# EAGLE design Arduino_Leonardo-REV3b (EAGLE 6.2)
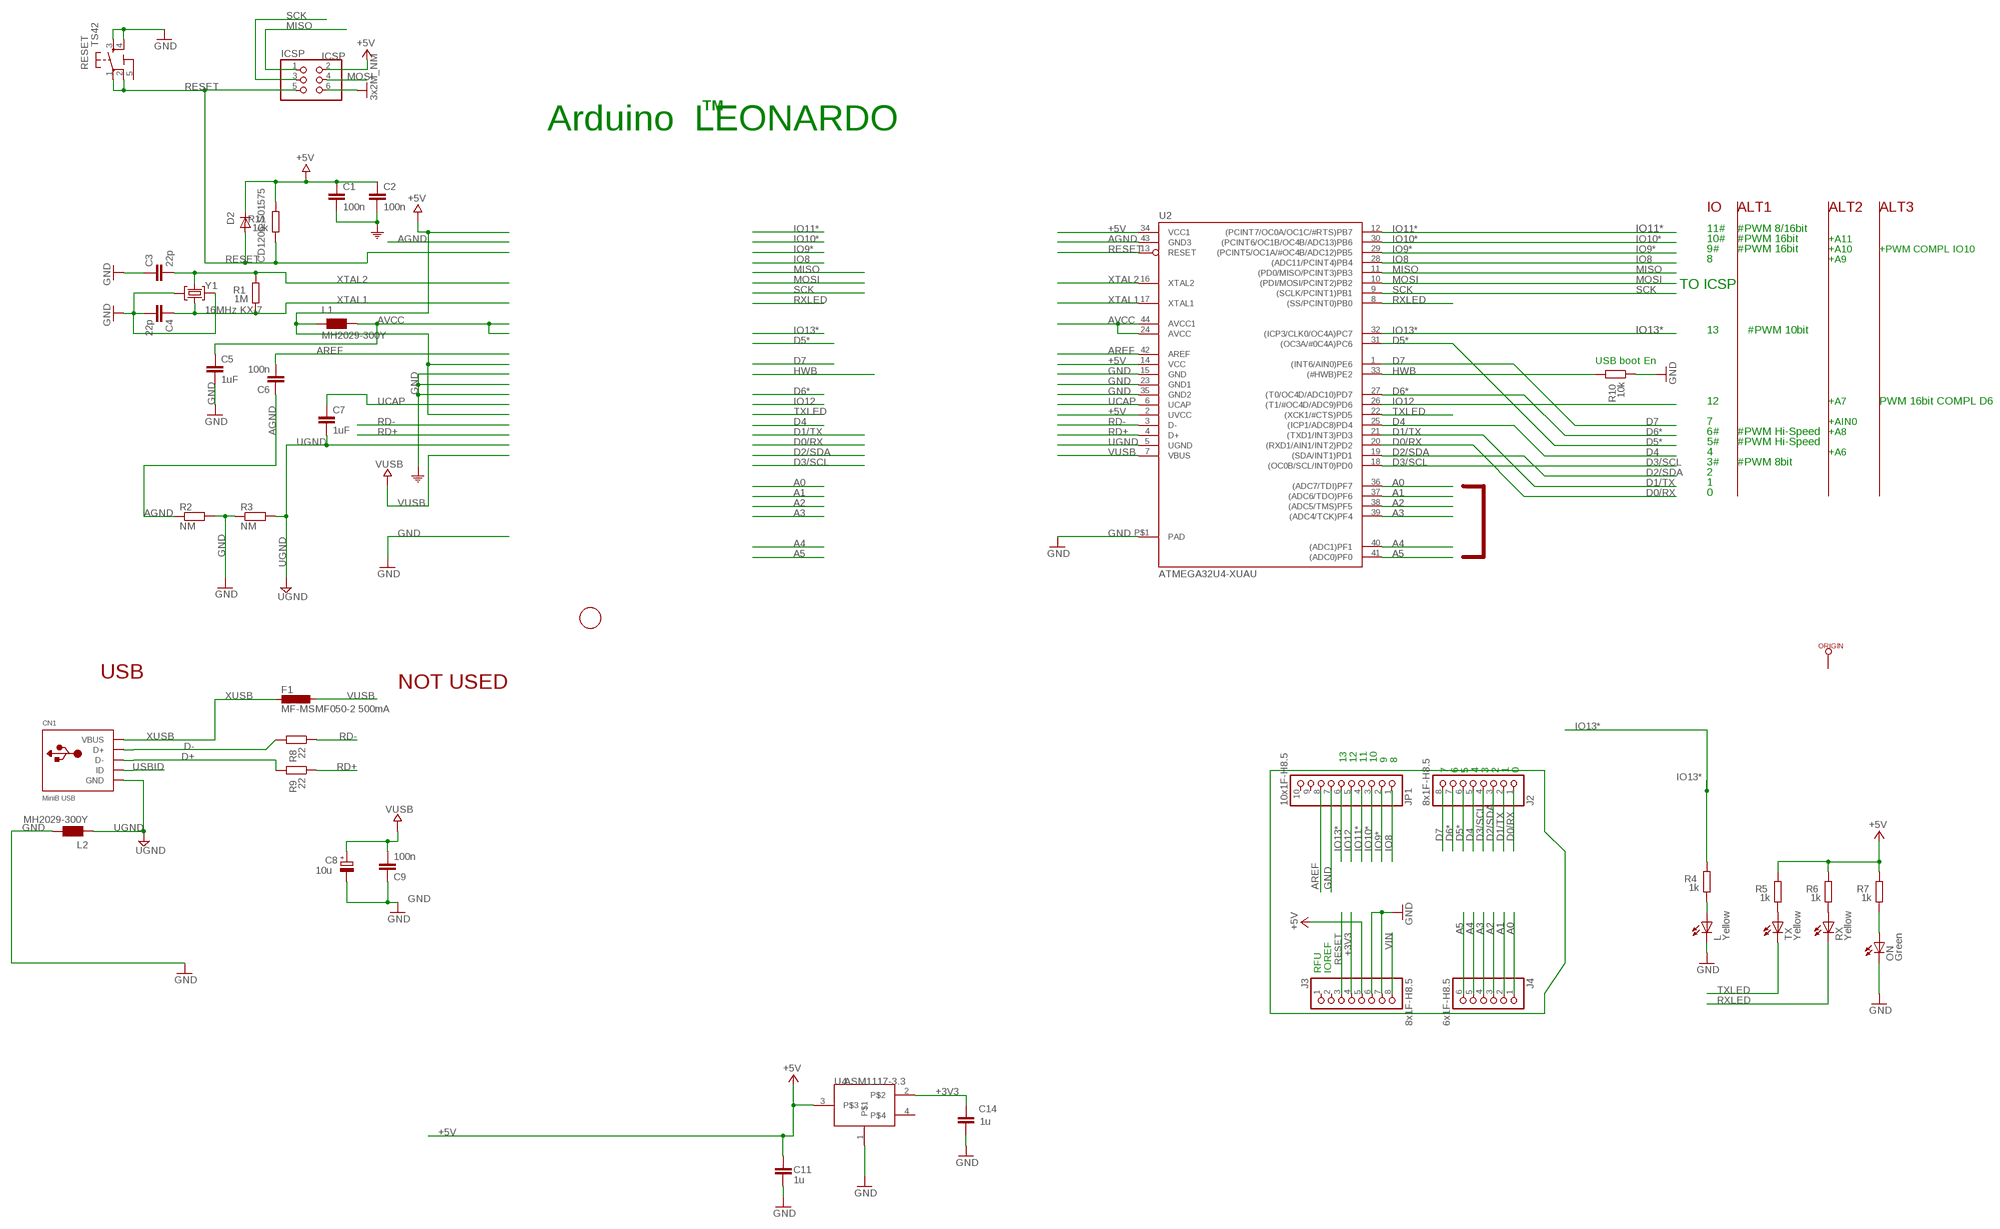
[diagram p0: schematic, sheet 1]

## Parts
C1  100n  C-EUC0805  [C0805]
C2  100n  C-EUC0805  [C0805]
C3  22p  C-EUC0805  [C0805]
C4  22p  C-EUC0805  [C0805]
C5  1uF  C-EUC0805  [C0805]
C6  100n  C-EUC0805  [C0805]
C7  1uF  C-EUC0805  [C0805]
C8  10u  CPOL-EUSMCB  [SMC_B]
C9  100n  C-EUC0805  [C0805]
C11  1u  C-EUC0805  [C0805]
C14  1u  C-EUC0805  [C0805]
CN1  MiniB USB  USBMINIB  [USB-MINIB]
D2  CD1206-S01575  DIODE-MINIMELF  [MINIMELF]
F1  MF-MSMF050-2 500mA  L-EUL1812  [L1812]
FID1  FIDUCIALMOUNT  [FIDUCIA-MOUNT]
ICSP  ICSP  PINHD-2X3  [2X03]
J2  8x1F-H8.5  PINHD-1X8  [1X08]
J3  8x1F-H8.5  PINHD-1X8  [1X08]
J4  6x1F-H8.5  PINHD-1X6  [1X06]
JP1  10x1F-H8.5  PINHD-1X10  [1X10]
L  Yellow  LEDCHIPLED_0805  [CHIPLED_0805]
L1  MH2029-300Y  WE-CBF_0805  [0805]
L2  MH2029-300Y  WE-CBF_0805  [0805]
ON  Green  LEDCHIPLED_0805  [CHIPLED_0805]
ORIGIN  TP_SP  [TP-SP]
R1  1M  R-EU_R0805  [R0805]
R2  NM  R-EU_R0805  [R0805]
R3  NM  R-EU_R0805  [R0805]
R4  1k  R-EU_R0805  [R0805]
R5  1k  R-EU_R0805  [R0805]
R6  1k  R-EU_R0805  [R0805]
R7  1k  R-EU_R0805  [R0805]
R8  22  R-EU_R0805  [R0805]
R9  22  R-EU_R0805  [R0805]
R10  10k  R-EU_R0805  [R0805]
R11  10k  R-EU_R0805  [R0805]
RESET  TS42  [TS42]
RX  Yellow  LEDCHIPLED_0805  [CHIPLED_0805]
TX  Yellow  LEDCHIPLED_0805  [CHIPLED_0805]
U2  ATMEGA32U4-XUAU  [TQFP44-PAD]
U4  ASM1117-3.3  [SOT223]
Y1  16MHz KX-7  CRYSTAL-3.2-2.5  [CRYSTAL-3.2-2.5]

## Nets
+3V3: C14.2 J3.4 U4.2
+5V [usbvcc]: C1.1 C2.1 C11.2 D2.C ICSP.2 J3.5 L1.1 R5.2 R6.2 R7.2 R11.2 U2.2(UVCC) U2.14(VCC) U2.34(VCC1) U4.3
A0: J4.1 U2.36((ADC7/TDI)PF7)
A1: J4.2 U2.37((ADC6/TDO)PF6)
A2: J4.3 U2.38((ADC5/TMS)PF5)
A3: J4.4 U2.39((ADC4/TCK)PF4)
A4: J4.5 U2.40((ADC1)PF1)
A5: J4.6 U2.41((ADC0)PF0)
AGND: C6.1 R2.1 U2.43(GND3)
AREF [aref]: C6.2 JP1.8 U2.42(AREF)
AVCC: C5.1 L1.2 U2.24(AVCC) U2.44(AVCC1)
D0/RX: J2.1 U2.20((RXD1/AIN1/INT2)PD2)
D1/TX: J2.2 U2.21((TXD1/INT3)PD3)
D2/SDA: J2.3 U2.19((SDA/INT1)PD1)
D3/SCL: J2.4 U2.18((OC0B/SCL/INT0)PD0)
D4: J2.5 U2.25((ICP1/ADC8)PD4)
D5*: J2.6 U2.31((OC3A/#0C4A)PC6)
D6*: J2.7 U2.27((T0/OC4D/ADC10)PD7)
D7: J2.8 U2.1((INT6/AIN0)PE6)
D+: CN1.D- R9.2
D-: CN1.D+ R8.2
GND [gnd]: C1.2 C2.2 C3.1 C4.2 C5.2 C8.- C9.1 C11.1 C14.1 ICSP.6 J3.6 J3.7 JP1.7 L2.2 L.C ON.C R2.2 R3.1 R10.1 RESET.3 RESET.4 U2.15(GND) U2.23(GND1) U2.35(GND2) U2.P$1(PAD) U4.1 Y1.2(GND) Y1.4(GND) ; supply symbol labelled 3x2M_NM, COM
HWB: R10.2 U2.33((#HWB)PE2)
IO8: JP1.1 U2.28((ADC11/PCINT4)PB4)
IO9*: JP1.2 U2.29((PCINT5/OC1A/#OC4B/ADC12)PB5)
IO10*: JP1.3 U2.30((PCINT6/OC1B/OC4B/ADC13)PB6)
IO11*: JP1.4 U2.12((PCINT7/OC0A/OC1C/#RTS)PB7)
IO12: JP1.5 U2.26((T1/#OC4D/ADC9)PD6)
IO13*: JP1.6 R4.2 U2.32((ICP3/CLK0/OC4A)PC7)
MISO: ICSP.1 U2.11((PD0/MISO/PCINT3)PB3)
MOSI: ICSP.4 U2.10((PDI/MOSI/PCINT2)PB2)
N$1: R5.1 TX.A
N$2: L.A R4.1
N$3: ON.A R7.1
N$4: R6.1 RX.A
RD+: R9.1 U2.4(D+)
RD-: R8.1 U2.3(D-)
RESET: D2.A ICSP.5 J3.3 R11.1 RESET.1 RESET.2 U2.13(RESET)
RXLED: RX.C U2.8((SS/PCINT0)PB0)
SCK: ICSP.3 U2.9((SCLK/PCINT1)PB1)
TXLED: TX.C U2.22((XCK1/#CTS)PD5)
UCAP: C7.1 U2.6(UCAP)
UGND [gnd]: C7.2 CN1.GND L2.1 R3.2 U2.5(UGND)
USBID: CN1.ID
VIN [power]: J3.8
VUSB: C8.+ C9.2 F1.1 U2.7(VBUS)
XTAL1: C4.1 R1.1 U2.17(XTAL1) Y1.1(C1)
XTAL2: C3.2 R1.2 U2.16(XTAL2) Y1.3(C2)
XUSB [usbvcc]: CN1.VBUS F1.2
Unconnected: J3.1 J3.2 JP1.9 JP1.10 ORIGIN.X(TESTP) U4.4

## Notes on the sheet
- TM
- Arduino  LEONARDO
- IO | ALT1 | ALT2 | ALT3
- 11# | #PWM 8/16bit
- 10# | #PWM 16bit | +A11
- 9# | #PWM 16bit | +A10 | +PWM COMPL IO10
- 8 | +A9
- TO ICSP
- 13 | #PWM 10bit
- USB boot En
- 12 | +A7 | PWM 16bit COMPL D6
- 7 | +AIN0
- 6# | #PWM Hi-Speed | +A8
- 5# | #PWM Hi-Speed
- 4 | +A6
- 3# | #PWM 8bit
- 2
- 1
- 0
- USB
- NOT USED
- 13 | 12 | 11 | 10 | 9 | 8
- 7 | 6 | 5 | 4 | 3 | 2 | 1 | 0
- RFU | IOREF

## Power pins joined to a net without a drawn wire
5-GND: RESET.5(5-GND)

## Library data of the parts
C1-C7 C9 C11 C14 = SmartPrj:C-EU: CAPACITOR, European symbol
C8 = rcl:CPOL-EU: POLARIZED CAPACITOR, European symbol
CN1 = adafruit:USB: USB Connectors USBMINIB - Surface Mount Female Mini-B USB Connector 4UConnector: 06564 By microbuilder.eu Thru-hole RA Female Mini-B USB Connector 4UConnector: 18732 By ladyada.net
D2 = diode:DIODE-: DIODE
F1 = rcl:L-EU: INDUCTOR, European symbol
FID1 = SmartPrj:FIDUCIALMOUNT
ICSP = SmartPrj:PINHD-2X3: PIN HEADER
J2 J3 = SmartPrj:PINHD-1X8: PIN HEADER
J4 = SmartPrj:PINHD-1X6: PIN HEADER
JP1 = SmartPrj:PINHD-1X10: PIN HEADER
L ON RX TX = led:LED: LED OSRAM: - CHIPLED LG R971, LG N971, LY N971, LG Q971, LY Q971, LO R971, LY R971 LH N974, LH R974 LS Q976, LO Q976, LY Q976 LO Q996 - Hyper CHIPLED LW Q18S LB Q993, LB Q99A, LB R99A - SideLED LS A670, LO A670, LY A670, LG A670, LP A670 LB A673, LV A673, LT A673, LW A673 LH A674 LY A675 LS A676, LA A676, LO A676, LY A676, LW A676 LS A679, LY A679, LG A679 - Hyper Micro SIDELED® LS Y876, LA Y876, LO Y876, LY Y876 LT Y87S - SmartLED LW L88C, LW L88S LB L89C, LB L89S, LG L890 LS L89K, LO L89K, LY L89K LS L896, LA L896, LO L896, LY L896 - TOPLED LS T670, LO T670, LY T670, LG T670, LP T670 LSG T670, LSP T670, LSY T670, LOP T670, LYG T670 LG T671, LOG T671, LSG T671 LB T673, LV T673, LT T673, LW T673 LH T674 LS T676, LA T676, LO T676, LY T676, LB T676, LH T676, LSB T676, LW T676 LB T67C, LV T67C, LT T67C, LS T67K, LO T67K, LY T67K, LW E67C LS E67B, LA E67B, LO E67B, LY E67B, LB E67C, LV E67C, LT E67C LW T67C LS T679, LY T679, LG T679 LS T770, LO T770, LY T770, LG T770, LP T770 LB T773, LV T773, LT T773, LW T773 LH T774 LS E675, LA E675, LY E675, LS T675 LS T776, LA T776, LO T776, LY T776, LB T776 LHGB T686 LT T68C, LB T68C - Hyper Mini TOPLED® LB M676 - Mini TOPLED Santana® LG M470 LS M47K, LO M47K, LY M47K Source: http://www.osram.convergy.de LUXEON: - LUMILED® LXK2-PW12-R00, LXK2-PW12-S00, LXK2-PW14-U00, LXK2-PW14-V00 LXK2-PM12-R00, LXK2-PM12-S00, LXK2-PM14-U00 LXK2-PE12-Q00, LXK2-PE12-R00, LXK2-PE12-S00, LXK2-PE14-T00, LXK2-PE14-U00 LXK2-PB12-K00, LXK2-PB12-L00, LXK2-PB12-M00, LXK2-PB14-N00, LXK2-PB14-P00, LXK2-PB14-Q00 LXK2-PR12-L00, LXK2-PR12-M00, LXK2-PR14-Q00, LXK2-PR14-R00 LXK2-PD12-Q00, LXK2-PD12-R00, LXK2-PD12-S00 LXK2-PH12-R00, LXK2-PH12-S00 LXK2-PL12-P00, LXK2-PL12-Q00, LXK2-PL12-R00 Source: www.luxeon.com KINGBRIGHT: KA-3528ASYC Source: www.kingbright.com
L1 L2 = wuerth-elektronik:WE-CBF: SMD EMI Suppression Ferrite Beads - excellent anti-EMI properties - low DCR - impedances till 3000 ohms - rated current up to 6 A
ORIGIN = SmartPrj:TP_SP
R1-R11 = SmartPrj:R-EU_: RESISTOR, European symbol
RESET = SmartPrj:TS42: TS42 Dongnan Electronics Tact switch VDC 12V - 50mA
U2 = SmartPrj:ATMEGA32U4-XU
U4 = Itead_IC_110429:ASM1117-3.3: ICP006
Y1 = SmartPrj:CRYSTAL-3.2-2.5

## Net classes
1 power: width 0.254 mm, drill 0.61 mm, clearance 0.254 mm
2 gnd: width 0.254 mm, drill 0.61 mm, clearance 0.254 mm
3 usbvcc: width 0.254 mm, drill 0.61 mm, clearance 0.254 mm
4 aref: width 0.254 mm, drill 0.61 mm, clearance 0.254 mm

## Board
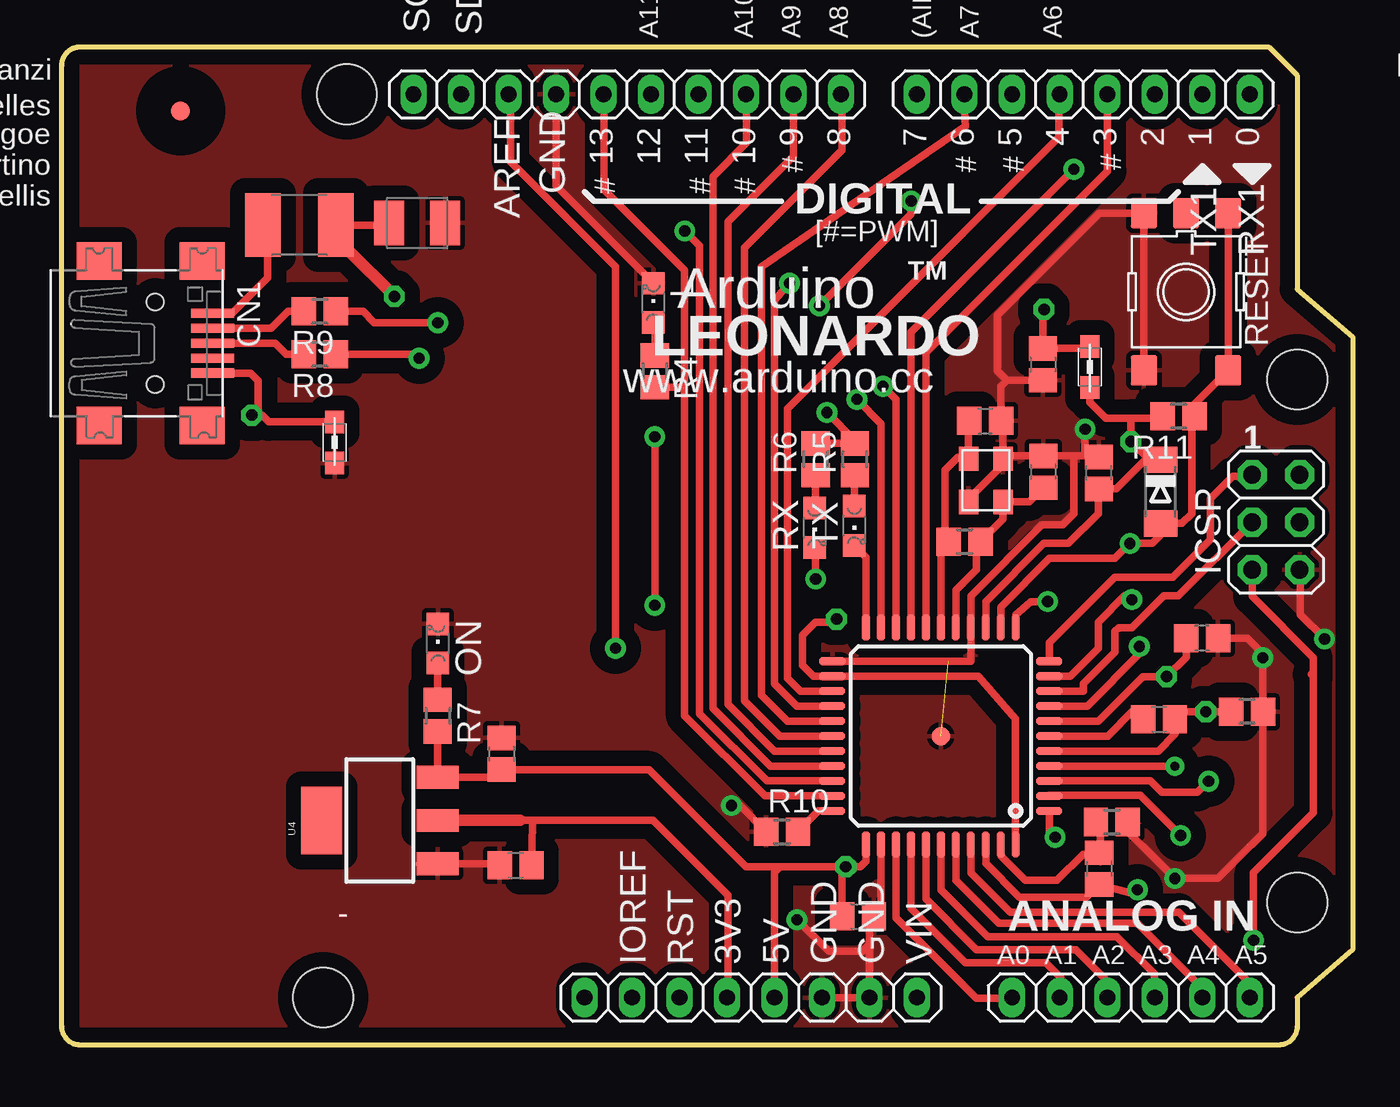
[diagram p1: board, top side]
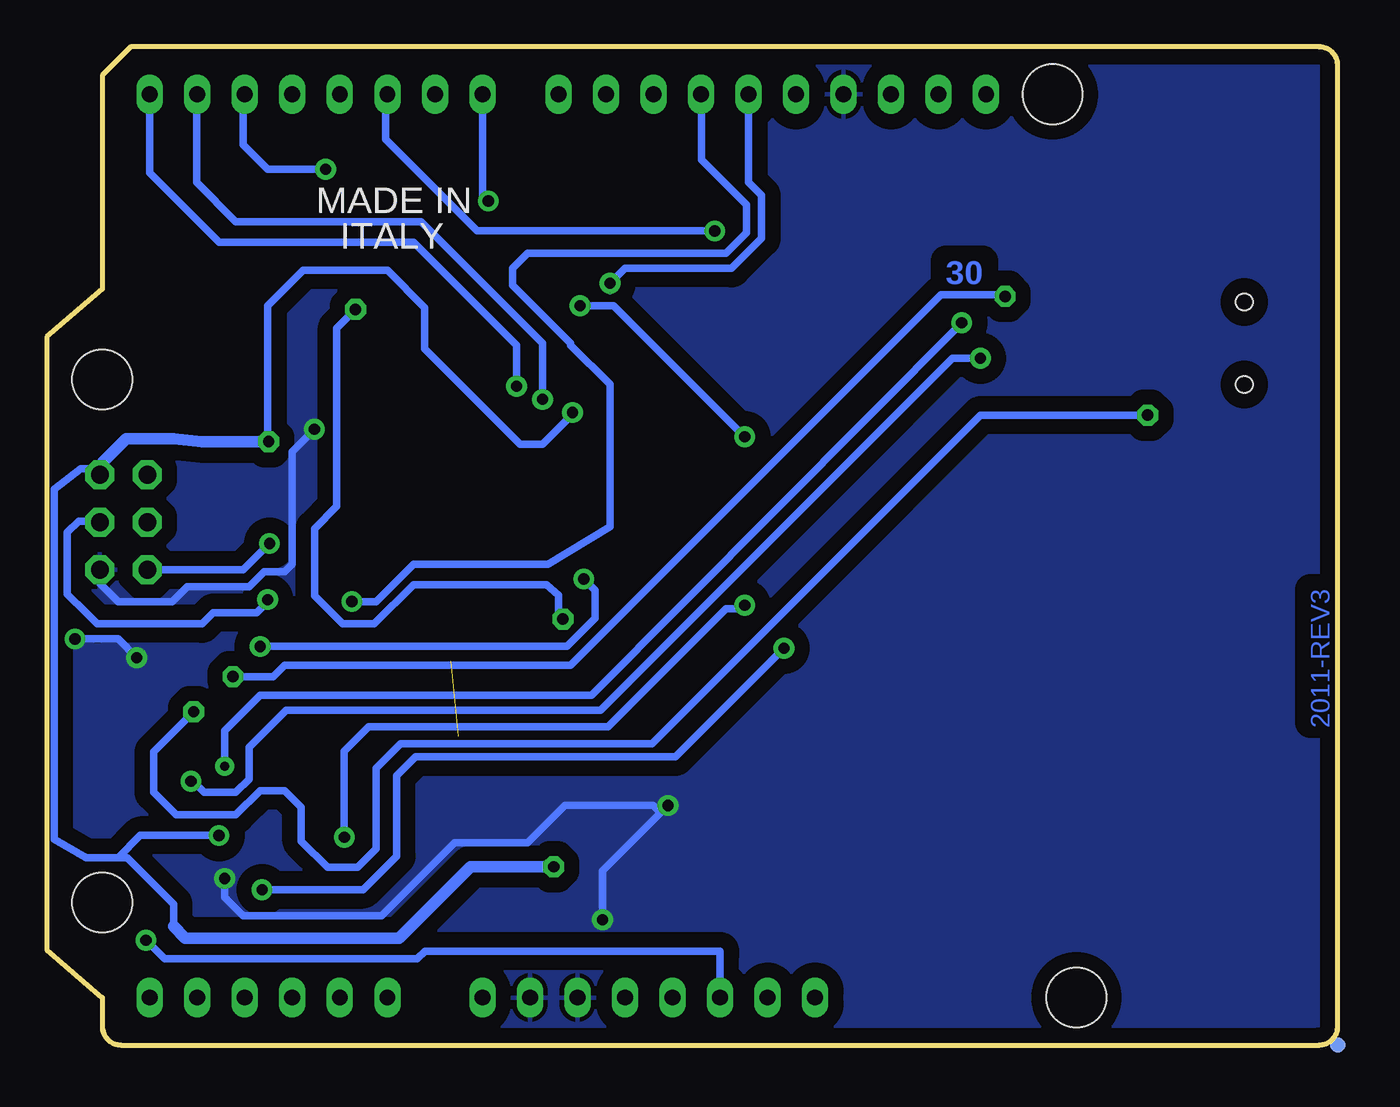
[diagram p2: board, bottom side, seen from below]

Size 69 x 53.34 mm. Coordinates in mm from the lower left corner, seen from the top.
Outline: 64.52,53.34 66.04,51.82 66.04,40.39 69,37.85 69,5.08 66.04,2.54 66.04,1 arc-90 65.04,0 1,0 arc-90 0,1 0,52.34 arc-90 1,53.34 64.52,53.34
Copper layers (1*16): Top 0.035mm / dielectric 1.5mm / Bottom 0.035mm
Design rules: minimum track width 10mil, minimum drill 22mil, track to track 10mil, track to pad 10mil, pad to pad 8mil, via to via 12mil, smd to smd 8mil, copper to edge 24mil, drill to drill 12mil, minimum pad ring 10mil, minimum via ring 10mil, stop-mask expansion 2mil, vias tented up to drill 30mil, thermal gap 10mil
Holes 3.2 mm at 66.04,35.56 66.04,7.62 15.24,50.8 13.97,2.54
vRestrict: area 42.5,38.6 to 43.1,38.9; area 35.8,35.2 to 36.4,35.7; area 44.5,35.2 to 45.2,35.7; area 41.3,35.2 to 41.8,35.7; area 47.9,10.3 to 48.5,10.8; area 50.4,10.2 to 50.9,11

### Footprints (pad centres in the part's own frame; a part is rotated, then mirrored left to right if it is on the bottom)
C0805 = smd 1.3 x 1.5: 1 -0.85,0; 2 0.85,0
SMC_B = smd 1.6 x 2.4: + -1.5,0; - 1.5,0
USB-MINIB = smd 0.5 x 2.308: D+ 0,4.064; D- -0.8,4.064; GND 1.6,4.064; ID 0.8,4.064; VBUS -1.6,4.064 | smd 2 x 2.4: GND1 -4.4,-2; GND2 -4.4,3.5; GND3 4.4,3.5; GND4 4.4,-2 | hole 0.9: -2.2,1; 2.2,1
MINIMELF = smd 1.4 x 1.8: A 1.7,0; C -1.7,0
L1812 = smd 1.9 x 3.4: 1 -1.95,0; 2 1.95,0
FIDUCIA-MOUNT = smd 1.016 x 1.016: P$1 0,0
2X03 = drill 0.95 pad 1.55 octagon: 1 -2.54,-1.27; 2 -2.54,1.27; 3 0,-1.27; 4 0,1.27; 5 2.54,-1.27; 6 2.54,1.27
1X08 = drill 0.85 pad 1.422 long: 1 -8.89,0; 2 -6.35,0; 3 -3.81,0; 4 -1.27,0; 5 1.27,0; 6 3.81,0; 7 6.35,0; 8 8.89,0
1X06 = drill 0.85 pad 1.422 long: 1 -6.35,0; 2 -3.81,0; 3 -1.27,0; 4 1.27,0; 5 3.81,0; 6 6.35,0
1X10 = drill 0.85 pad 1.422 long: 1 -11.43,0; 2 -8.89,0; 3 -6.35,0; 4 -3.81,0; 5 -1.27,0; 6 1.27,0; 7 3.81,0; 8 6.35,0; 9 8.89,0; 10 11.43,0
CHIPLED_0805 = smd 1.2 x 1.2: A 0,-1.05; C 0,1.05
0805 = smd 1.2 x 1: 1 -1.1,0; 2 1.1,0
TP-SP = smd 0.8 x 0.8 bottom: X 0,0
R0805 = smd 1.3 x 1.5: 1 -0.85,0; 2 0.85,0
TS42 = smd 1.6 x 1.4: 1 -4.2,2.25; 2 4.2,2.25; 3 -4.2,-2.25; 4 4.2,-2.25; 5 -4.2,0
TQFP44-PAD = smd 1.4 x 0.45: 1 -5.8,4; 2 -5.8,3.2; 3 -5.8,2.4; 4 -5.8,1.6; 5 -5.8,0.8; 6 -5.8,0; 7 -5.8,-0.8; 8 -5.8,-1.6; 9 -5.8,-2.4; 10 -5.8,-3.2; 11 -5.8,-4; 23 5.8,-4; 24 5.8,-3.2; 25 5.8,-2.4; 26 5.8,-1.6; 27 5.8,-0.8; 28 5.8,0; 29 5.8,0.8; 30 5.8,1.6; 31 5.8,2.4; 32 5.8,3.2; 33 5.8,4 | smd 0.45 x 1.4: 12 -4,-5.8; 13 -3.2,-5.8; 14 -2.4,-5.8; 15 -1.6,-5.8; 16 -0.8,-5.8; 17 0,-5.8; 18 0.8,-5.8; 19 1.6,-5.8; 20 2.4,-5.8; 21 3.2,-5.8; 22 4,-5.8; 34 4,5.8; 35 3.2,5.8; 36 2.4,5.8; 37 1.6,5.8; 38 0.8,5.8; 39 0,5.8; 40 -0.8,5.8; 41 -1.6,5.8; 42 -2.4,5.8; 43 -3.2,5.8; 44 -4,5.8 | smd 1 x 1: P$1 0,0
SOT223 = smd 1.219 x 2.235: 1 -2.311,-3.099; 2 0,-3.099; 3 2.311,-3.099 | smd 3.6 x 2.2: 4 0,3.099
CRYSTAL-3.2-2.5 = smd 1.3 x 1.05: 1 -1.15,-0.925; 2 1.15,-0.925; 3 1.15,0.925; 4 -1.15,0.925

### Placement (x,y rotation side)
C1  42.56,6.88 0 top
C2  55.44,30.57 90 top
C3  52.47,30.63 270 top
C4  49.36,33.35 0 top
C5  52.45,36.37 270 top
C6  55.45,9.43 270 top
C7  58.65,17.41 0 top
C8  19,43.92 0 top
C9  60.95,21.73 180 top
C11  23.52,15.56 270 top
C14  24.27,9.61 0 top
CN1  4,37.5 270 top
D2  58.73,29.57 270 top
F1  12.7,43.81 180 top
FID1  6.35,49.91 0 top
ICSP  64.9,27.94 270 top
J2  54.61,50.8 180 top
J3  36.83,2.54 0 top
J4  57.15,2.54 0 top
JP1  30.23,50.8 180 top
L  31.62,39.66 0 top
L1  54.95,36.23 90 top
L2  14.59,32.2 270 top
ON  20.11,21.45 0 top
ORIGIN  0,0 0 top
R1  48.26,26.9 0 top
R2  56.13,11.92 0 top
R3  63.36,17.82 180 top
R4  31.7,36 270 top
R5  42.4,31.3 90 top
R6  40.3,31.3 90 top
R7  20.1,17.6 270 top
R8  13.8,36.9 180 top
R9  13.8,39.2 180 top
R10  38.5,11.4 0 top
R11  59.7,33.6 180 top
RESET  60.1,40.25 270 top
RX  40.26,27.64 180 top
TX  42.37,27.75 180 top
U2  46.99,16.51 180 top
U4  17,12 90 top
Y1  49.4,30.18 270 top

### Tracks (layer width: path | path; a pad name or v marks a point on that pad's centre or on a via)
+3V3
  Top 0.406: 26.1,12 25.5,12 | 25.5,12 25.3,12 | 25.3,12 24.5,12 | C14.2 25.15,11.85 25.3,12 | J3.4 35.6,2.58 35.6,8 31.6,12 25.5,12
  Top 0.61: U4.2 24,12 24.5,12
+5V  (via drill 0.6, 0.61)
  Top 0.305: 52.77,13.34 U2.2
  Top 0.406: U2.34 42.99,10.61 42.99,9.81 42.7,9.53 v41.91,9.53 | C1.1 41.72,9.33 v41.91,9.53 | U2.14 49.39,23.69 52.5,26.8 53.8,26.8 55.4,28.4 55.4,29.68 C2.1 56.37,29.72 58.02,31.37 | L1.1 54.95,34.34 55.8,33.5 57.2,33.5 | 57.2,33.5 58.75,33.5 R11.2 | v41.91,9.53 38.4,9.53 | 38.4,9.53 36.58,9.53 31.4,14.7 C11.2 23.38,14.31 U4.3 R7.2 | J3.5 38.1,9.22 38.4,9.53 | R6.2 R5.2 42.4,32.3 v40.9,33.8 | D2.C 58.02,31.37 | 58.02,31.37 v57.15,32.24 57.15,33.45 57.2,33.5 | 52.77,13.34 57.15,13.34 57.66,13.34 58.6,12.4 v59.8,11.2
  Bottom 0.406: 62.23,6.35 62.23,7.53 64.7,10 65.2,10 | 65.2,10 66.9,10 68.6,11 68.6,29.7 67.2,30.8 66.49,30.8 ICSP.2 | v40.9,33.8 40.9,33.7 42.5,32.1 43.7,32.1 48.8,37.2 48.8,39.4 50.8,41.4 55.3,41.4 57.2,39.5 57.2,32.3 v57.15,32.24 | v59.8,11.2 64,11.2 65.2,10
  Bottom 0.61: v57.15,32.24 60.69,32.24 62.23,32.38 64.77,32.38 66.04,31.11 ICSP.2 | v41.91,9.53 46.35,9.53 50.16,5.71 60.2,5.71 61.59,5.71 62.23,6.35
A0
  Top 0.406: U2.36 44.59,6.81 48.9,2.5 50.76,2.5 J4.1
A1
  Top 0.406: U2.37 45.39,7.31 48.3,4.4 52.6,4.4 53.4,3.6 53.4,2.6 J4.2
A2
  Top 0.406: U2.38 46.19,7.81 48.9,5.1 54.2,5.1 55.9,3.4 55.9,2.56 J4.3
A3
  Top 0.406: U2.39 46.99,8.31 49.5,5.8 56.4,5.8 58.4,3.8 58.4,2.56 J4.4
A4
  Top 0.406: U2.40 47.79,8.81 50.1,6.5 57.5,6.5 60.9,3.1 60.9,2.6 J4.5
A5
  Top 0.406: U2.41 48.59,9.21 50.7,7.1 59.7,7.1 63.6,3.2 63.6,2.64 J4.6
AGND
  Top 0.406: C6.1 55.55,11.35 R2.1 | 55.52,9.8 C6.1 | U2.43 50.19,10.11 51.5,8.8 53.2,8.8 54.6,10.2 55.38,10.2 C6.1
AREF  (via drill 0.6)
  Top 0.406: v57.5,8.3 57.27,8.07 C6.2 54.77,7.9 51.2,7.9 49.39,9.71 U2.42 | v29.6,21.2 29.6,41.6 24,47.2 24,50.68 JP1.8
  Bottom 0.406: v57.5,8.3 52.1,8.3 50.3,10.1 50.3,14.4 49.3,15.4 35.4,15.4 v29.6,21.2
AVCC  (via drill 0.61)
  Top 0.305: U2.44 50.97,10.72
  Top 0.406: 50.97,10.72 50.97,17.43 49,19.7 41.58,19.7 U2.24 40.19,19.71 39.6,20.3 39.6,21.9 40.3,22.6 41.25,22.6 v41.41,22.76 | L1.2 54.84,37.22 C5.1 52.45,39.26 v52.5,39.31
  Bottom 0.406: v41.41,22.76 41.64,22.76 41.64,24.04 42.3,24.6 49.4,24.6 51.5,22.5 53.2,22.5 54.7,24 54.7,27.6 53.5,28.8 53.5,38.31 v52.5,39.31
D0/RX  (via drill 0.6)
  Top 0.406: U2.20 44.59,34.51 v43.9,35.2
  Bottom 0.406: v43.9,35.2 43.9,37.4 49.4,42.9 59.8,42.9 63.5,46.6 J2.1
D1/TX  (via drill 0.6)
  Top 0.406: U2.21 43.79,33.21 v42.5,34.5
  Bottom 0.406: v42.5,34.5 42.5,37.5 49,44 58.9,44 61,46.1 61,50.76 J2.2
D2/SDA  (via drill 0.6)
  Top 0.406: U2.19 45.39,38.09 v54.1,46.8
  Bottom 0.406: v54.1,46.8 57.2,46.8 58.5,48.1 58.5,50.72 J2.3
D3/SCL
  Top 0.406: U2.18 46.19,36.99 55.9,46.7 55.9,50.78 J2.4
D4
  Top 0.406: U2.25 39.59,18.91 39.49,18.91 38.8,19.6 38.8,34 38.9,34.1 | J2.5 53.3,50.76 53.3,48.5 51.8,47 38.9,34.1 | 38.9,34.1 39.3,34.5
D5*  (via drill 0.6)
  Top 0.406: U2.31 37.69,14.11 34.1,17.7 34.1,42.7 v33.3,43.5
  Bottom 0.406: v33.3,43.5 46,43.5 50.9,48.4 50.9,50.7 J2.6
D6*
  Top 0.406: U2.27 38.79,17.31 37.4,18.7 37.4,41.6 48.3,49.1 48.2,50.74 J2.7
D7  (via drill 0.6)
  Top 0.406: U2.1 52.79,11.41 v53.1,11.1 | v45.4,45.1 45.4,44.4 v40.5,39.5 | v31.7,32.5 v31.7,23.5
  Bottom 0.406: v53.1,11.1 53.1,15.7 51.8,17 39,17 32.7,23.3 31.7,23.3 v31.7,23.5 | J2.8 45.72,45.42 v45.4,45.1 | v40.5,39.5 38.7,39.5 v31.7,32.5
D+
  Top 0.406: CN1.D- 11.2,38.3 12.1,39.2 R9.2
D-
  Top 0.406: CN1.D+ 11.4,37.5 12,36.9 R8.2
GND  (via drill 0.6)  (1 unrouted)
  Top 0.406: U2.23 47.4,20.51 48.59,20.51 U2.15 48.59,23.99 52.4,27.8 53.5,27.8 54.1,28.4 54.1,31.4 54.2,31.5 | Y1.4 50.27,31.48 C3.1 52.48,31.5 54.2,31.5 | RESET.4 RESET.3 55.45,44.45 50,39 50,36.04 50.52,35.52 | Y1.4 50.32,33.24 C4.2 50.2,35.2 50.52,35.52 | 54.2,31.5 54.6,31.5 | 54.6,31.5 55.36,31.5 C2.2 | C5.2 50.52,35.52 | Y1.2 48.47,29.17 50.1,30.8 50.1,31.11 Y1.4 | U4.1 23.33,9.69 C14.1 | C9.1 63.37,21.73 64.2,20.9 v64.2,20.7 | v64.2,20.7 64.2,19.7 | 64.2,19.7 R3.1 64.2,11.3 62.9,10 61.8,8.9 v59.5,8.9 58.4,10 57.08,11.32 R2.2 | v54.7,32.9 54.7,31.6 54.6,31.5 | ICSP.6 66.2,25.37 66.2,23 v67.5,21.7 | v64.2,20.7 64.2,19.7 | U2.35 43.79,7.25 C1.2 43.18,6.64 43.18,6.3 | J3.6 J3.7 43.18,6.3 | 43.18,6.3 43.18,5.38 42.8,5 41,5 v39.3,6.7 | v35.8,12.8 36.25,12.8 R10.1 | JP1.7 26.42,45.91 L.C
  Bottom 0.406: ICSP.6 66.17,24.67 65.2,23.7 62.3,23.7 61.5,24.5 58.2,24.5 57.4,25.3 56.3,25.3 55.9,25.7 55.9,31.7 v54.7,32.9 | v67.5,21.7 65.2,21.7 v64.2,20.7 | v39.3,6.7 39.3,9.3 36.2,12.4 | 36.2,12.4 v35.8,12.8 | v59.5,8.9 59.5,7.9 58.5,6.9 51.1,6.9 47.2,10.8 43.3,10.8 41.3,12.8 36.6,12.8 36.2,12.4
  pour Bottom (isolate 0.813, rank 2): 0.64,52.7 69.22,52.7 69.22,0.64 1.64,0.64 arc-90 0.64,1.64
  pour Top (isolate 0.813, rank 2): 0.64,52.7 71.62,52.91 71.62,1.83 arc-90 70.12,0.64 1.64,0.64 arc-90 0.64,1.64
HWB
  Top 0.406: U2.33 40.46,12.51 R10.2
IO8
  Top 0.406: U2.28 38.39,16.51 36.5,18.4 36.5,42.6 41.7,47.8 41.7,50.76 JP1.1
IO9*
  Top 0.406: U2.29 38.09,15.71 35.6,18.2 35.6,44 39.1,47.5 39.1,50.78 JP1.2
IO10*
  Top 0.406: U2.30 37.89,14.91 34.8,18 34.8,46.4 36.6,48.2 36.6,50.78 JP1.3
IO11*  (via drill 0.6)
  Top 0.406: U2.12 50.99,22.99 51.8,23.7 v52.7,23.7
  Bottom 0.406: v52.7,23.7 51.4,23.7 49.4,25.7 42.2,25.7 38.9,27.7 38.9,35.3 41,37.4 41,37.5 44.1,40.6 44.1,41.5 43.3,42.3 40,42.3 32.7,42.3 31.6,43.4 31.6,44.9 34,47.3 34,50.76 JP1.4
IO12  (via drill 0.6)
  Top 0.406: U2.26 39.29,18.11 38.1,19.3 38.1,39.8 v38.9,40.7
  Bottom 0.406: 38.9,40.3 v38.9,40.7 38.1,41.5 32.4,41.5 30.8,43.1 30.8,45.4 31.5,46.1 JP1.5
IO13*
  Top 0.406: U2.32 37.59,13.31 33.3,17.6 33.3,35 | 33.3,35 33.3,41.4 29,45.7 29,50.76 JP1.6 | R4.2 33.15,35.15 33.3,35
MISO
  Top 0.406: U2.11 52.79,21.49 56.3,25 59.4,25 61.4,27 61.4,29.2 62.6,30.4 63.55,30.4 ICSP.1
MOSI  (via drill 0.6)
  Top 0.406: U2.10 53.91,19.71 55.4,21.2 55.4,22.6 56.8,24 57,24 v57.2,23.8
  Bottom 0.406: ICSP.4 66.23,28 67.3,28 67.9,27.4 67.9,24.1 66.9,23.1 66.3,22.5 60.7,22.5 60.1,23.1 57.8,23.1 57.2,23.7 v57.2,23.8
N$1
  Top 0.406: TX.A 42.37,30.42 R5.1
N$2
  Top 0.406: R4.1 31.7,38.52 L.A
N$3
  Top 0.406: R7.1 ON.A
N$4
  Top 0.406: R6.1 40.3,28.73 RX.A
RD+  (via drill 0.5, 0.6)
  Top 0.305: 52.98,14.9 U2.4
  Top 0.406: R9.1 16.1,39.2 16.7,38.6 19.2,38.6 v20.1,38.6 | 52.98,14.9 v59.5,14.9
  Bottom 0.406: v59.5,14.9 59.5,16.8 57.6,18.7 39.9,18.7 v20.1,38.6
RD-  (via drill 0.6)
  Top 0.406: R8.1 18.9,36.9 v19.1,36.7 | U2.3 58.19,14.11 58.8,13.5 60.7,13.5 v61.3,14.1
  Bottom 0.406: v19.1,36.7 20.6,36.7 39.4,17.9 56.2,17.9 58.2,15.9 58.2,14.2 58.9,13.5 60.6,13.5 61.2,14.1 v61.3,14.1
RESET  (via drill 0.6)
  Top 0.406: RESET.2 RESET.1 | 62.4,36 RESET.2 | U2.13 50.19,23.39 52.8,26 56.3,26 v57.1,26.8 58.3,26.8 58.7,27.2 58.7,27.84 D2.A 59.87,27.87 60.4,28.4 60.4,33.45 R11.1 60.55,34.25 RESET.2 | v63.7,5.6 63.7,9.2 66.9,12.4 66.9,19.6 | 66.9,19.6 66.9,19.7 66.8,19.8 | ICSP.5 63.63,23.97 66.9,20.7 66.9,19.6
  Bottom 0.406: ICSP.5 58.5,25.4 v57.1,26.8 | J3.3 33.02,4.82 33.02,5.02 48.78,5.02 49.2,4.6 62.7,4.6 v63.7,5.6
RXLED  (via drill 0.6)
  Top 0.406: U2.8 54.81,18.11 57.6,20.9 v57.6,21.3 | v40.3,24.9 40.3,26.55 RX.C
  Bottom 0.406: v57.6,21.3 41.2,21.3 39.7,22.8 39.7,24.3 v40.3,24.9
SCK
  Top 0.406: U2.9 54.6,18.91 54.6,19.3 56.3,21 56.3,22.1 56.5,22.3 57.2,22.3 58.9,24 59.69,24 ICSP.3
TXLED
  Top 0.406: U2.22 42.99,26.07 TX.C
UCAP
  Top 0.406: U2.6 55.91,16.51 57.2,17.8 57.71,17.8 C7.1
UGND  (via drill 0.61)
  Top 0.406: CN1.GND 10.1,35.9 10.5,35.5 10.5,33.99 v10.16,33.66 10.7,33.66 11.05,33.3 L2.1 | U2.5 58.21,15.71 58.61,15.71 59.5,16.6 C7.2 | 59.6,17.1 59.6,17.61 C7.2 | C7.2 59.6,17.81 v61.16,17.81 v61.16,17.82 R3.2
  Bottom 0.406: v10.16,33.66 19.1,33.66 36.66,16.1 38.7,16.1 50.1,16.1 51.4,14.8 51.4,10.5 52.4,9.5 54,9.5 55.4,10.9 55.4,12.7 56.3,13.6 57.6,13.6 58.9,12.3 60.7,12.3 62.1,12.3 63.3,13.5 63.3,15.66 v61.16,17.81
VUSB  (via drill 0.61)
  Top 0.406: U2.7 55.41,17.31 56.62,18.52 57.78,19.68 v59.05,19.68 60.1,20.73 C9.2 | F1.1 17.39,43.81 C8.+
  Top 0.61: F1.1 15.29,42.5 v17.78,40.01
  Bottom 0.406: v59.05,19.68 56.91,19.68 56.3,20.3 41,20.3 21.2,40.1 17.88,40.1 v17.78,40.01
XTAL1
  Top 0.406: U2.17 46.99,26.48 R1.1 47.41,27.19 47.2,27.4 47.2,30.7 47.21,30.71 47.9,31.4 48.4,31.4 Y1.1 48.47,33.31 C4.1
XTAL2
  Top 0.406: U2.16 47.79,24.29 48.9,25.4 48.9,26.69 R1.2 48.91,26.71 50.3,28.1 50.3,29 Y1.3 51.71,29.02 C3.2
XUSB
  Top 0.406: CN1.VBUS 9.1,39.1 11,41 11,43.56 F1.2

### Text on the board
Bottom: 30 | 2011-REV3
tPlace: PWM COMPL1 | PWM COMPL2 | Prototype | Limited | 13 | 12 | 11 | 10 | 9 | 8 | 7 | 6 | 5 | 4 | 3 | 2 | 1 | 0 | Edition | -
tNames: SCL | SDA | A11 | A10 | A9 | A8 | (AIN0) | A7 | A6 | M.Banzi | D.Cuartielles | T.Igoe | G.Martino | # | # | # | # | D.Mellis | GND | # | # | # | AREF | DIGITAL | [#=PWM] | TX1 | RX1 | TM | Arduino | LEONARDO | www.arduino.cc | 1 | ANALOG IN | IOREF | RST | 3V3 | 5V | GND | GND | VIN | A0 | A1 | A2 | A3 | A4 | A5
bNames: MADE IN | ITALY
ReferenceLC: X2